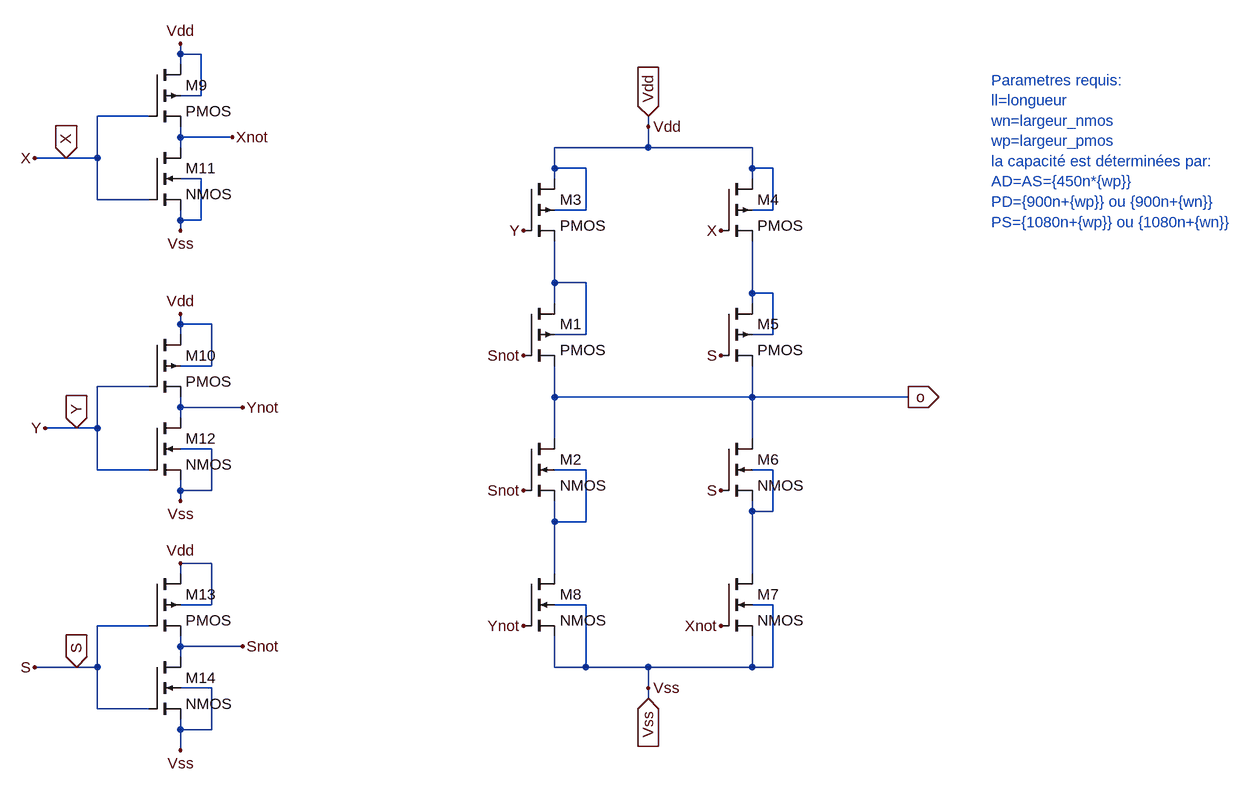
[diagram p0: schematic mux2x1.asc]
mux2x1.asc, the LTspice schematic file:
Version 4
SHEET 1 1564 932
WIRE -144 -224 -144 -240
WIRE -112 -224 -144 -224
WIRE -144 -208 -144 -224
WIRE -112 -160 -112 -224
WIRE -112 -160 -144 -160
WIRE -192 -128 -272 -128
WIRE 576 -112 576 -128
WIRE -144 -96 -144 -112
WIRE -64 -96 -144 -96
WIRE -144 -80 -144 -96
WIRE 576 -80 576 -112
WIRE 576 -80 432 -80
WIRE 736 -80 576 -80
WIRE -320 -64 -368 -64
WIRE -272 -64 -272 -128
WIRE -272 -64 -320 -64
WIRE 432 -48 432 -80
WIRE 480 -48 432 -48
WIRE 736 -48 736 -80
WIRE 768 -48 736 -48
WIRE -112 -32 -144 -32
WIRE 432 -32 432 -48
WIRE 736 -32 736 -48
WIRE -272 0 -272 -64
WIRE -192 0 -272 0
WIRE 480 16 480 -48
WIRE 480 16 432 16
WIRE 768 16 768 -48
WIRE 768 16 736 16
WIRE -144 32 -144 16
WIRE -112 32 -112 -32
WIRE -112 32 -144 32
WIRE -144 48 -144 32
WIRE 432 128 432 64
WIRE 480 128 432 128
WIRE 736 144 736 64
WIRE 768 144 736 144
WIRE 432 160 432 128
WIRE 736 160 736 144
WIRE -144 192 -144 176
WIRE -96 192 -144 192
WIRE -144 208 -144 192
WIRE 480 208 480 128
WIRE 480 208 432 208
WIRE 768 208 768 144
WIRE 768 208 736 208
WIRE -96 256 -96 192
WIRE -96 256 -144 256
WIRE -192 288 -272 288
WIRE 432 304 432 256
WIRE 736 304 736 256
WIRE 736 304 432 304
WIRE 976 304 736 304
WIRE -144 320 -144 304
WIRE -48 320 -144 320
WIRE -144 336 -144 320
WIRE -304 352 -352 352
WIRE -272 352 -272 288
WIRE -272 352 -304 352
WIRE 432 368 432 304
WIRE 736 368 736 304
WIRE -96 384 -144 384
WIRE -272 416 -272 352
WIRE -192 416 -272 416
WIRE 480 416 432 416
WIRE 768 416 736 416
WIRE -144 448 -144 432
WIRE -96 448 -96 384
WIRE -96 448 -144 448
WIRE -144 464 -144 448
WIRE 736 480 736 464
WIRE 768 480 768 416
WIRE 768 480 736 480
WIRE 432 496 432 464
WIRE 480 496 480 416
WIRE 480 496 432 496
WIRE -96 560 -144 560
WIRE -144 576 -144 560
WIRE 432 576 432 496
WIRE 736 576 736 480
WIRE -96 624 -96 560
WIRE -96 624 -144 624
WIRE 480 624 432 624
WIRE 768 624 736 624
WIRE -192 656 -272 656
WIRE -144 688 -144 672
WIRE -48 688 -144 688
WIRE -144 704 -144 688
WIRE -304 720 -368 720
WIRE -272 720 -272 656
WIRE -272 720 -304 720
WIRE 432 720 432 672
WIRE 480 720 480 624
WIRE 480 720 432 720
WIRE 576 720 480 720
WIRE 736 720 736 672
WIRE 736 720 576 720
WIRE 768 720 768 624
WIRE 768 720 736 720
WIRE -96 752 -144 752
WIRE 576 752 576 720
WIRE 576 768 576 752
WIRE -272 784 -272 720
WIRE -192 784 -272 784
WIRE -144 816 -144 800
WIRE -96 816 -96 752
WIRE -96 816 -144 816
WIRE -144 848 -144 816
FLAG 576 -128 Vdd
IOPIN 576 -128 In
FLAG 576 768 Vss
IOPIN 576 768 In
FLAG 976 304 o
IOPIN 976 304 Out
FLAG -144 -240 Vdd
FLAG -144 176 Vdd
FLAG -144 560 Vdd
FLAG -144 464 Vss
FLAG -144 848 Vss
FLAG -144 48 Vss
FLAG -368 -64 X
FLAG -352 352 Y
FLAG -368 720 S
FLAG -64 -96 Xnot
FLAG -48 320 Ynot
FLAG -48 688 Snot
FLAG 688 48 X
FLAG 688 656 Xnot
FLAG 384 240 Snot
FLAG 384 448 Snot
FLAG 384 656 Ynot
FLAG 688 448 S
FLAG 688 240 S
FLAG 384 48 Y
FLAG -320 -64 X
IOPIN -320 -64 In
FLAG -304 352 Y
IOPIN -304 352 In
FLAG -304 720 S
IOPIN -304 720 In
FLAG 576 752 Vss
FLAG 576 -112 Vdd
SYMBOL pmos4 384 160 R0
SYMATTR InstName M1
SYMATTR Value2 l={ll} w={wp} ad={450n*{wp}} as={450n*{wp}} pd={900n+{wp}} ps={1080n+{wp}}
SYMBOL nmos4 384 368 R0
SYMATTR InstName M2
SYMATTR Value2 l={ll} w={wn} ad={450n*{wn}} as={450n*{wn}} pd={900n+{wn}} ps={1080n+{wn}}
SYMBOL pmos4 384 -32 R0
SYMATTR InstName M3
SYMATTR Value2 l={ll} w={wp} ad={450n*{wp}} as={450n*{wp}} pd={900n+{wp}} ps={1080n+{wp}}
SYMBOL pmos4 688 -32 R0
SYMATTR InstName M4
SYMATTR Value2 l={ll} w={wp} ad={450n*{wp}} as={450n*{wp}} pd={900n+{wp}} ps={1080n+{wp}}
SYMBOL pmos4 688 160 R0
SYMATTR InstName M5
SYMATTR Value2 l={ll} w={wp} ad={450n*{wp}} as={450n*{wp}} pd={900n+{wp}} ps={1080n+{wp}}
SYMBOL nmos4 688 368 R0
SYMATTR InstName M6
SYMATTR Value2 l={ll} w={wn} ad={450n*{wn}} as={450n*{wn}} pd={900n+{wn}} ps={1080n+{wn}}
SYMBOL nmos4 688 576 R0
SYMATTR InstName M7
SYMATTR Value2 l={ll} w={wn} ad={450n*{wn}} as={450n*{wn}} pd={900n+{wn}} ps={1080n+{wn}}
SYMBOL nmos4 384 576 R0
SYMATTR InstName M8
SYMATTR Value2 l={ll} w={wn} ad={450n*{wn}} as={450n*{wn}} pd={900n+{wn}} ps={1080n+{wn}}
SYMBOL pmos4 -192 -208 R0
SYMATTR InstName M9
SYMATTR Value2 l={ll} w={wp} ad={450n*{wp}} as={450n*{wp}} pd={900n+{wp}} ps={1080n+{wp}}
SYMBOL pmos4 -192 208 R0
SYMATTR InstName M10
SYMATTR Value2 l={ll} w={wp} ad={450n*{wp}} as={450n*{wp}} pd={900n+{wp}} ps={1080n+{wp}}
SYMBOL nmos4 -192 -80 R0
SYMATTR InstName M11
SYMATTR Value2 l={ll} w={wn} ad={450n*{wn}} as={450n*{wn}} pd={900n+{wn}} ps={1080n+{wn}}
SYMBOL nmos4 -192 336 R0
SYMATTR InstName M12
SYMATTR Value2 l={ll} w={wn} ad={450n*{wn}} as={450n*{wn}} pd={900n+{wn}} ps={1080n+{wn}}
SYMBOL pmos4 -192 576 R0
SYMATTR InstName M13
SYMATTR Value2 l={ll} w={wp} ad={450n*{wp}} as={450n*{wp}} pd={900n+{wp}} ps={1080n+{wp}}
SYMBOL nmos4 -192 704 R0
SYMATTR InstName M14
SYMATTR Value2 l={ll} w={wn} ad={450n*{wn}} as={450n*{wn}} pd={900n+{wn}} ps={1080n+{wn}}
TEXT 1104 -184 Left 2 ;Parametres requis: \nll=longueur \nwn=largeur_nmos \nwp=largeur_pmos\nla capacité est déterminées par:\nAD=AS={450n*{wp}}\nPD={900n+{wp}} ou {900n+{wn}}\nPS={1080n+{wp}} ou {1080n+{wn}}

The netlist it stands for:
* mux2x1.asc
M1 N001 Snot o N001 PMOS l={ll} w={wp} ad={450n*{wp}} as={450n*{wp}} pd={900n+{wp}} ps={1080n+{wp}}
M2 o Snot N003 N003 NMOS l={ll} w={wn} ad={450n*{wn}} as={450n*{wn}} pd={900n+{wn}} ps={1080n+{wn}}
M3 Vdd Y N001 Vdd PMOS l={ll} w={wp} ad={450n*{wp}} as={450n*{wp}} pd={900n+{wp}} ps={1080n+{wp}}
M4 Vdd X N002 Vdd PMOS l={ll} w={wp} ad={450n*{wp}} as={450n*{wp}} pd={900n+{wp}} ps={1080n+{wp}}
M5 N002 S o N002 PMOS l={ll} w={wp} ad={450n*{wp}} as={450n*{wp}} pd={900n+{wp}} ps={1080n+{wp}}
M6 o S N004 N004 NMOS l={ll} w={wn} ad={450n*{wn}} as={450n*{wn}} pd={900n+{wn}} ps={1080n+{wn}}
M7 N004 Xnot Vss Vss NMOS l={ll} w={wn} ad={450n*{wn}} as={450n*{wn}} pd={900n+{wn}} ps={1080n+{wn}}
M8 N003 Ynot Vss Vss NMOS l={ll} w={wn} ad={450n*{wn}} as={450n*{wn}} pd={900n+{wn}} ps={1080n+{wn}}
M9 Vdd X Xnot Vdd PMOS l={ll} w={wp} ad={450n*{wp}} as={450n*{wp}} pd={900n+{wp}} ps={1080n+{wp}}
M10 Vdd Y Ynot Vdd PMOS l={ll} w={wp} ad={450n*{wp}} as={450n*{wp}} pd={900n+{wp}} ps={1080n+{wp}}
M11 Xnot X Vss Vss NMOS l={ll} w={wn} ad={450n*{wn}} as={450n*{wn}} pd={900n+{wn}} ps={1080n+{wn}}
M12 Ynot Y Vss Vss NMOS l={ll} w={wn} ad={450n*{wn}} as={450n*{wn}} pd={900n+{wn}} ps={1080n+{wn}}
M13 Vdd S Snot Vdd PMOS l={ll} w={wp} ad={450n*{wp}} as={450n*{wp}} pd={900n+{wp}} ps={1080n+{wp}}
M14 Snot S Vss Vss NMOS l={ll} w={wn} ad={450n*{wn}} as={450n*{wn}} pd={900n+{wn}} ps={1080n+{wn}}
.model NMOS NMOS
.model PMOS PMOS
.lib standard.mos
* Parametres requis:
* ll=longueur
* wn=largeur_nmos
* wp=largeur_pmos
* la capacité est déterminées par:
* AD=AS={450n*{wp}}
* PD={900n+{wp}} ou {900n+{wn}}
* PS={1080n+{wp}} ou {1080n+{wn}}
.backanno
.end